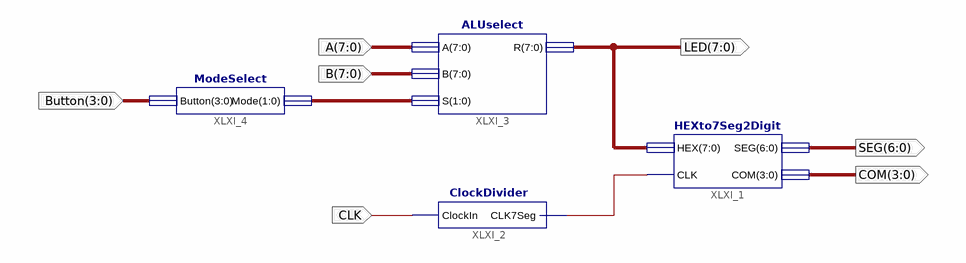
[diagram p0: schematic sheet 1]
// Xilinx ISE schematic ALU.sch (spartan6) as structural Verilog: 4 symbols, 7 ports
module ALU (
  input  CLK,
  input  [7:0] A,
  input  [7:0] B,
  input  [3:0] Button,
  output [7:0] LED,
  output [6:0] SEG,
  output [3:0] COM
);

  wire XLXN_2;
  wire [1:0] XLXN_10;

  HEXto7Seg2Digit XLXI_1 (.HEX(LED), .CLK(XLXN_2), .SEG(SEG), .COM(COM));
  ClockDivider XLXI_2 (.ClockIn(CLK), .CLK7Seg(XLXN_2));
  ALUselect XLXI_3 (.A(A), .B(B), .S(XLXN_10), .R(LED));
  ModeSelect XLXI_4 (.Button(Button), .Mode(XLXN_10));
endmodule
